# EasyEDA Pro project INA240.epro

# Schematic Schematic1
Board Name: Board1; Create Date: 2025-07-30; Page Name: P1; Project Name: INA240; Schematic Name: Schematic1; Update Date: 2025-08-01; Company: 嘉立创EDA; Page Size: A4; Version: V1.0
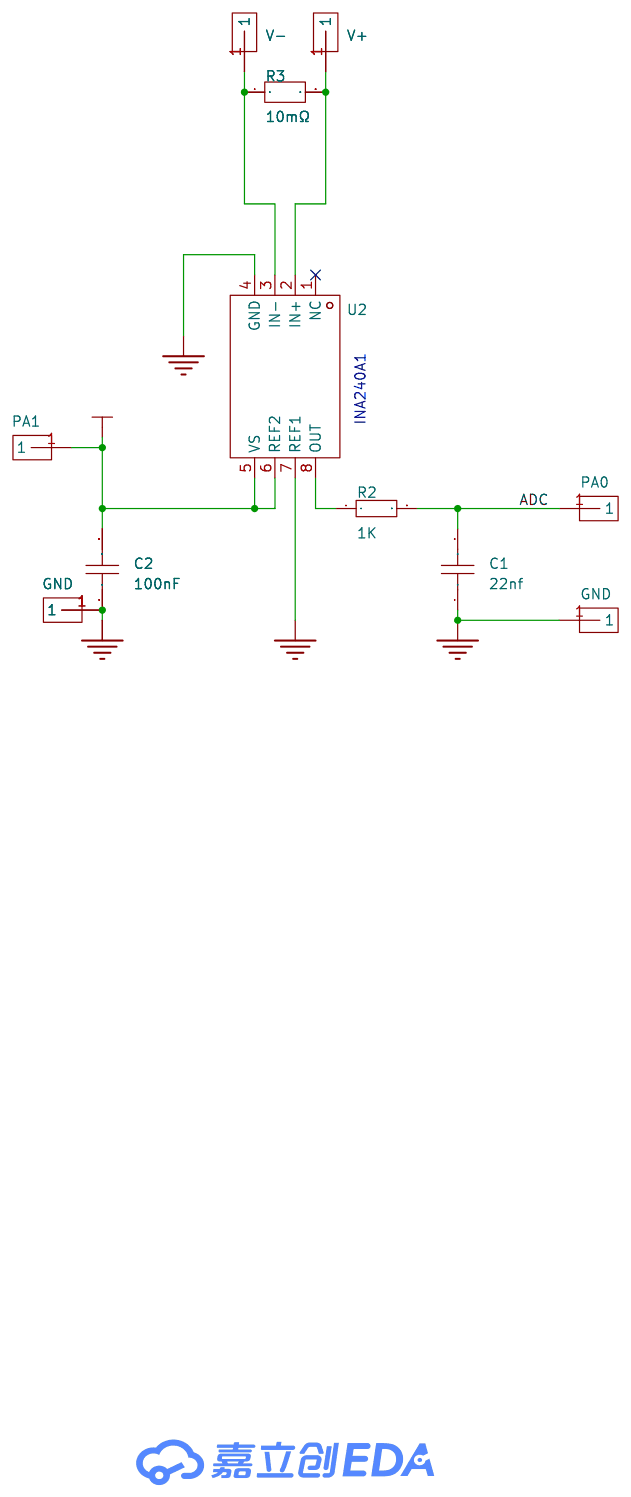
[diagram p0: schematic sheet]

## Parts
C1  22nf  [C0603]
C2  100nF  [C0603]
GND  -  [贴片焊盘]
GND#2  -  [贴片焊盘]
PA0  -  [贴片焊盘]
PA1  -  [贴片焊盘]
R2  1K  [R0603]
R3  10mΩ  [R2512]
U2  INA240A2PWR  [TSSOP-8_L4.4-W3.0-P0.65-LS6.4-BL]
V+  -  [贴片焊盘]
V-  -  [贴片焊盘]

## Library data of the parts
C1 C2 = CAP_0603: Supplier Footprint: 0603
GND GND#2 PA0 PA1 V+ V- = 贴片焊盘
R2 = Res_0603: Supplier Footprint: 0603
R3 = JER2512F3R010: 电阻类型:采样电阻;阻值:10mΩ;精度:±1%;功率:3W;温度系数:±50ppm/℃;; LCSC Part Name: 10mΩ 3W 2512 ±1%; Supplier Part: C46634450; Manufacturer: 捷而瑞; Supplier Footprint: 2512; JLCPCB Part Class: 扩展库; Datasheet: https://atta.szlcsc.com/upload/public/pdf/source/20250318/D554CC95569B02A455FAE3D181D671EA.pdf; Supplier: LCSC; Type: 采样电阻; Tolerance: ±1%; Power(Watts): 3W; Temperature Coefficient: ±50ppm/℃
U2 = INA240A2PWR: 放大器数:单路;; Supplier Part: C129949; Manufacturer: TI(德州仪器); Supplier Footprint: TSSOP-8; JLCPCB Part Class: 扩展库; Datasheet: https://www.ti.com/cn/lit/gpn/ina240; Supplier: LCSC; Number of Channels: 单路; Supply Current: 1.8mA; Operating Temperature: -40℃~+125℃

## Nets
3.3V: C2.2 PA1.1 U2.5(VS) U2.6(REF2)
GND: C1.1 C2.1 GND.1 GND#2.1 U2.4(GND) U2.7(REF1)
ADC: C1.2 PA0.1 R2.2
Net-(R2-1): R2.1 U2.8(OUT)
Net-(R3-1): R3.1 U2.3(IN-) V-.1
Net-(R3-2): R3.2 U2.2(IN+) V+.1

Not connected (* = marked no-connect by the designer): U2 1(NC)*

## Notes on the sheet
- INA240A1

# Board PCB1
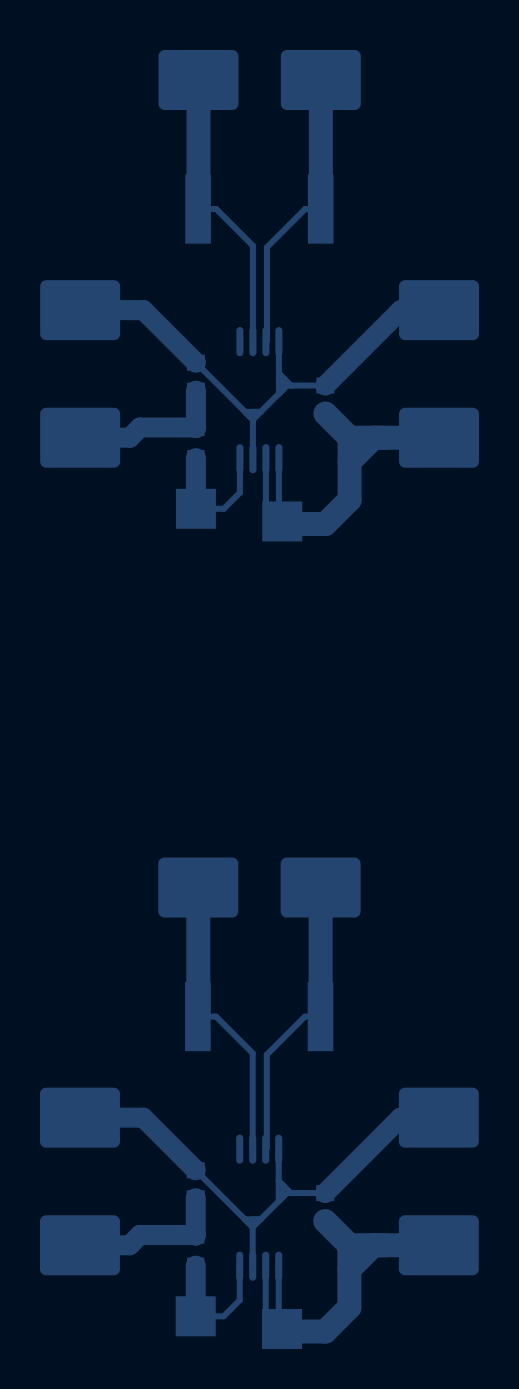
[diagram p1: board, top side]
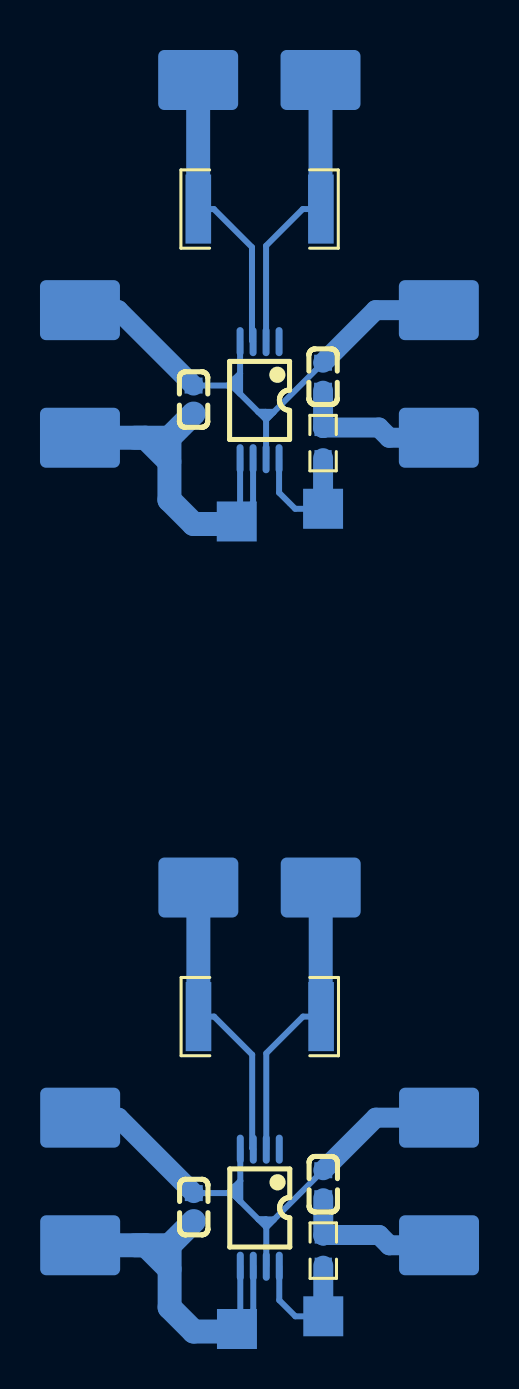
[diagram p2: board, bottom side, seen from below]

No outline. copper layers: Top Layer, Bottom Layer. Coordinates in mm from the lowest, leftmost part position.
Stack: Top Layer 0.035mm / Dielectric1 1.51mm FR4 er 4.5 / Bottom Layer 0.035mm

## Design rules (mm)
template: JLCPCB Capability(Two Layers Board)
spacing copperThickness1oz (default): track to track 0.102, other pairs 0.152 to 0.3
spacing copperThickness2oz: track to track 0.203, other pairs 0.152 to 0.3
track width copperThickness1oz (default): min 0.127, default 0.254, max 2.54
track width copperThickness2oz: min 0.203, default 0.254, max 2.54
differential pair differentialPair (default): width min 0.127, default 0.254, max 2.54; gap min 0.152, default 0.152
via viaSize (default): diameter min 0.5, default 0.61, max 10; hole min 0.3, default 0.305, max 6.3

## Placement (name value [footprint] x y rotation side)
C1  22nf  [C0603]  5.8 47.62 270 bottom
C1#2  -  [C0603]  5.79 7.24 270 bottom
C2  100nF  [C0603]  12.28 46.47 270 bottom
C2#2  -  [C0603]  12.27 6.1 270 bottom
CN1  -  [贴片焊盘]  10.11 0 270 bottom
CN1#2  -  [贴片焊盘]  10.12 40.38 270 bottom
CN2  -  [贴片焊盘]  5.79 0.63 270 bottom
CN2#2  -  [贴片焊盘]  5.8 41.01 270 bottom
R2  1K  [R0603]  5.8 44.3 90 bottom
R2#2  -  [R0603]  5.79 3.92 90 bottom
R3  10mΩ  [R2512]  8.97 56 180 bottom
R3#2  -  [R2512]  8.97 15.62 180 bottom
U2  INA240A2PWR  [TSSOP-8_L4.4-W3.0-P0.65-LS6.4-BL]  8.98 46.44 0 bottom
U2#2  -  [TSSOP-8_L4.4-W3.0-P0.65-LS6.4-BL]  8.97 6.07 0 bottom
U3  -  [贴片焊盘#2]  12.05 62.45 0 bottom
U3#2  -  [贴片焊盘#2]  12.04 22.07 0 bottom
U4  -  [贴片焊盘#2]  5.93 62.45 0 bottom
U4#2  -  [贴片焊盘#2]  5.92 22.07 0 bottom
U5  -  [贴片焊盘#2]  0.01 44.56 0 bottom
U5#2  -  [贴片焊盘#2]  0 4.19 0 bottom
U6  -  [贴片焊盘#2]  0.01 50.94 0 bottom
U6#2  -  [贴片焊盘#2]  0 10.57 0 bottom
U7  -  [贴片焊盘#2]  17.96 44.56 180 bottom
U7#2  -  [贴片焊盘#2]  17.95 4.19 180 bottom
U8  -  [贴片焊盘#2]  17.96 50.94 180 bottom
U8#2  -  [贴片焊盘#2]  17.95 10.57 180 bottom

## Footprints (pads in the part's own frame, mm; a bottom-side part is the same pattern mirrored in y, then rotated)
C0603
  rect 0.8x0.9 smd: 1(-0.7,0) 2(0.7,0)
R0603
  rect 0.806x0.864 smd: 1(-0.753,0) 2(0.753,0)
R2512
  rect 1.282x3.456 smd: 1(-3.067,0) 2(3.067,0)
TSSOP-8_L4.4-W3.0-P0.65-LS6.4-BL
  oval 0.353x1.454 smd: 1(-0.975,-2.927) 2(-0.325,-2.927) 3(0.325,-2.927) 4(0.975,-2.927) 5(0.975,2.927) 6(0.325,2.927) 7(-0.325,2.927) 8(-0.975,2.927)
贴片焊盘
  rect 2x2 smd: 1(0,0)
贴片焊盘#2
  rrect 4x3 smd: 1(0,0)

## Nets
5V: C2.2 C2#2.2 CN1.1 CN1#2.1 U2.5 U2.6 U2#2.5 U2#2.6 U7.1 U7#2.1
GND: C1.1 C1#2.1 C2.1 C2#2.1 U2.4 U2.7 U2#2.4 U2#2.7 U6.1 U6#2.1 U8.1 U8#2.1
ADC: C1.2 C1#2.2 R2.2 R2#2.2 U5.1 U5#2.1
$1N1861: R3.1 R3#2.1 U2.3 U2#2.3 U3.1 U3#2.1
$1N1867: R3.2 R3#2.2 U2.2 U2#2.2 U4.1 U4#2.1
$1N1948: CN2.1 CN2#2.1 R2.1 R2#2.1 U2.8 U2#2.8

Pads without a net: U2 1; U2#2 1

## Routing (per net, layer and track width the routed paths; a pad name or vN(x,y) marks a point on that pad's centre or on a via; arc(x,y) is an arc through that point)
5V: length 38.9
  Bottom Layer w0.3: U2.6 9.3,41.32 9.95,40.67 ; 9.95,40.67 10.37,40.25 ; 9.95,40.67 U2.5 ; 9.94,0.29 10.36,-0.13 ; 9.94,0.29 U2#2.5 ; 9.94,0.29 9.29,0.94 U2#2.6
  Bottom Layer w1.2: 13.48,4.19 13.48,1.08 12.27,-0.13 10.36,-0.13 ; 13.48,4.19 C2#2.2 ; 13.48,4.19 U7#2.1 ; 10.37,40.25 12.28,40.25 13.49,41.46 13.49,44.56 ; 13.49,44.56 U7.1 ; 13.49,44.56 C2.2
GND: length 53.8
  Bottom Layer w0.3: U2.4 9.95,47.78 10.56,47.17 ; 10.56,47.17 10.36,47.17 8.65,45.47 ; 10.56,47.17 C2.1 ; 10.55,6.8 10.35,6.8 8.64,5.09 ; 10.55,6.8 C2#2.1 ; 10.55,6.8 9.94,7.41 U2#2.4 ; 8.65,45.47 C1.1 ; 8.65,45.47 U2.7 ; 8.64,5.09 C1#2.1 ; 8.64,5.09 U2#2.7
  Bottom Layer w1: U6#2.1 3.16,10.57 C1#2.1 ; U6.1 3.17,50.94 C1.1 ; U8#2.1 16.04,10.57 C2#2.1 ; C2.1 16.05,50.94 U8.1
ADC: length 15.8
  Bottom Layer w1: C1#2.2 R2#2.2 5.76,4.7 3,4.7 2.48,4.19 U5#2.1 ; C1.2 R2.2 5.77,45.08 3.01,45.08 2.49,44.56 U5.1
$1N1861: length 29.4
  Bottom Layer w0.3: U2#2.3 9.35,9.05 9.35,13.72 11.25,15.62 R3#2.1 ; R3.1 11.26,56 9.36,54.09 9.36,49.43 U2.3
  Bottom Layer w1.2: R3#2.1 12.04,15.63 U3#2.1 ; R3.1 12.05,56.01 U3.1
$1N1867: length 29.5
  Bottom Layer w0.3: 5.9,15.62 6.81,15.62 8.64,13.79 U2#2.2 ; U2.2 8.65,54.16 6.82,56 R3.2
  Bottom Layer w1.2: 5.9,15.62 5.92,15.64 U4#2.1 ; R3.2 5.93,56.02 U4.1
$1N1948: length 13.5
  Bottom Layer w0.3: U2#2.8 7.99,1.44 7.19,0.63 CN2.1 ; U2.8 8,41.82 7.2,41.01 CN2#2.1
  Bottom Layer w1: R2.1 CN2#2.1 ; R2#2.1 CN2.1
